# Altium schematic sheet shy-mirror-sensor-rev.SchDoc
size A4; SheetNumber: 1; SheetTotal: 1
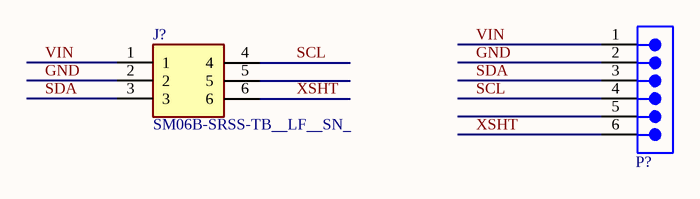
[diagram p0: shy-mirror-sensor-rev.SchDoc]

## Parts
J?  SM06B-SRSS-TB__LF__SN_  [SM06B-SRSS-TB]
P?  62000611121  [62000611121]  (value not drawn)

## Nets
GND: J?.2 P?.2
SCL: J?.4 P?.4
SDA: J?.3 P?.3
VIN: J?.1 P?.1
XSHT: J?.6 P?.6

Not connected (* = marked no-connect by the designer): J? 5; P? 5

## Library data of the parts
J? = SM06B-SRSS-TB__LF__SN_: Connector; Manufacturer_Name: JST (JAPAN SOLDERLESS TERMINALS); Manufacturer_Part_Number: SM06B-SRSS-TB (LF)(SN); Datasheet Link: http://uk.rs-online.com/web/p/products/5468827
P? = 62000611121: WR-PHD Pin Header, THT, Vertical, pitch 2mm, 1 Row, 6P; Manufacturer: Wurth Elektronik; Contact Resistance: 20mOhm; Rated Current: 2A; Working Voltage: 200V; Withstanding Voltage: 500V; Manufacturer Part Number: 62000611121; Category: Board-to-Board Connectors; Match Code: WR-PHD; ComponentLink1Description: Website Link; ComponentLink1URL: https://www.we-online.com/redexpert/article/62000611121?ad; ComponentLink2Description: Datasheet Link; ComponentLink2URL: https://www.we-online.com/redexpert/spec/62000611121?ad; Mount: Through Hole; Operating Temperature Max: 105°C; Operating Temperature Min: -40°C; Packaging: Bag; Gender: Pin Header; Number of Pins: 6; Number of Rows: 1; Orientation: Vertical; Pitch: 2mm